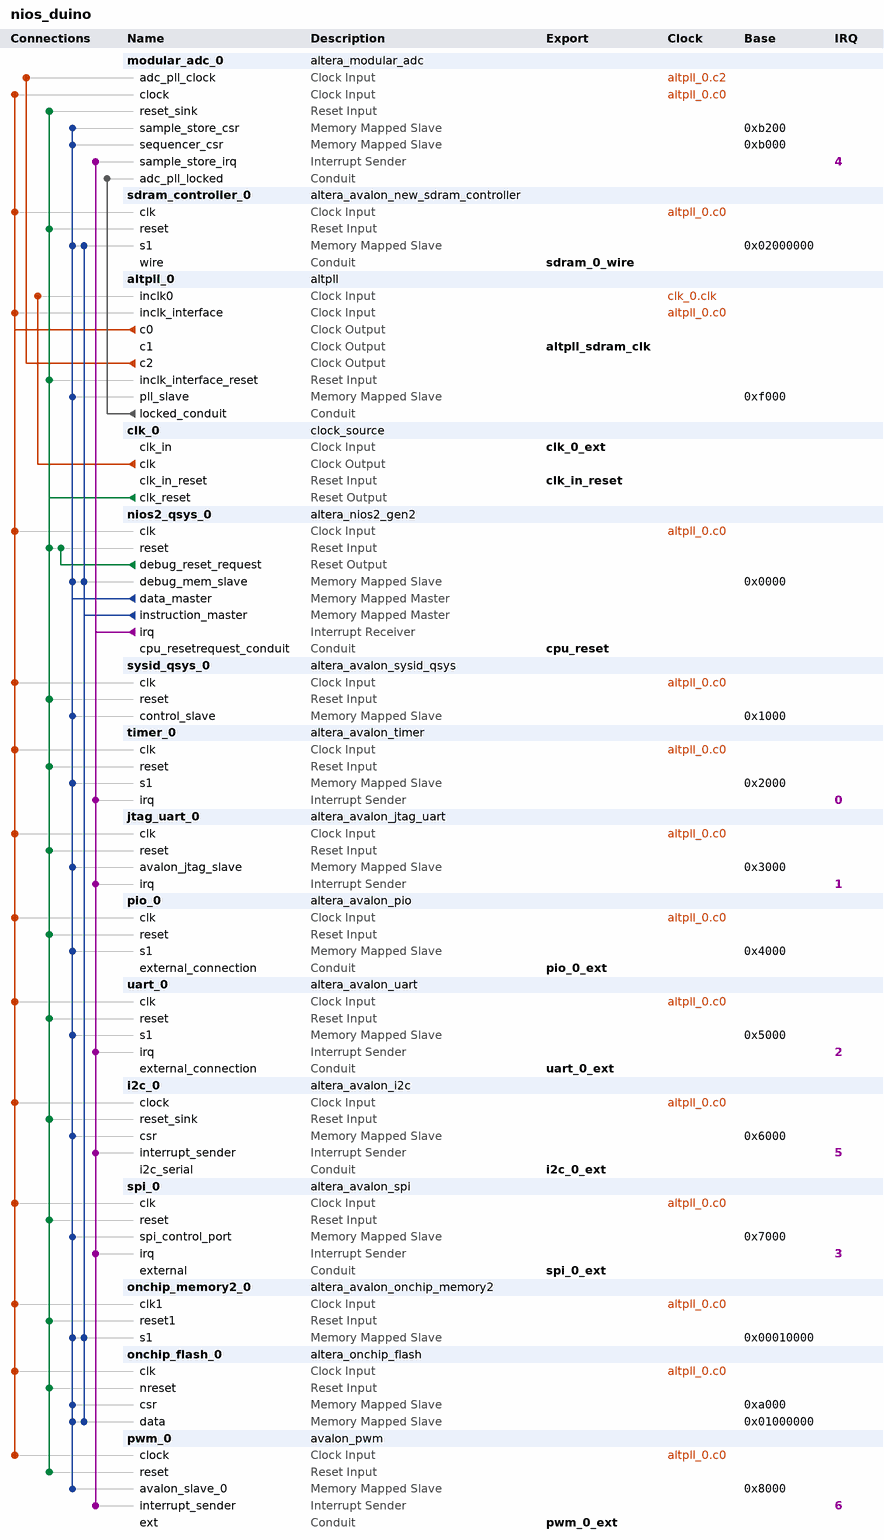
[diagram p0: system contents]
# Platform Designer (Qsys) system nios_duino, MAX 10 10M16SAU169C8G
# Parameters at their usual value, and those the tool derives, are not listed.
package require -exact qsys 17.0
create_system nios_duino
set_project_property DEVICE_FAMILY {MAX 10}
set_project_property DEVICE 10M16SAU169C8G

add_instance modular_adc_0 altera_modular_adc 17.0
set_instance_parameter_value modular_adc_0 CLOCK_FREQ 60000000
set_instance_parameter_value modular_adc_0 CORE_VAR 0
set_instance_parameter_value modular_adc_0 DEVICE_PART 10M16SAU169C8G
set_instance_parameter_value modular_adc_0 clkdiv 4
set_instance_parameter_value modular_adc_0 int_vref_vr 3.3
set_instance_parameter_value modular_adc_0 prescaler_ch8 true
set_instance_parameter_value modular_adc_0 refsel 1
set_instance_parameter_value modular_adc_0 sample_rate 0
set_instance_parameter_value modular_adc_0 seq_order_length 9
set_instance_parameter_value modular_adc_0 seq_order_slot_1 0
set_instance_parameter_value modular_adc_0 seq_order_slot_10 17
set_instance_parameter_value modular_adc_0 seq_order_slot_2 8
set_instance_parameter_value modular_adc_0 seq_order_slot_3 2
set_instance_parameter_value modular_adc_0 seq_order_slot_4 5
set_instance_parameter_value modular_adc_0 seq_order_slot_5 1
set_instance_parameter_value modular_adc_0 seq_order_slot_6 3
set_instance_parameter_value modular_adc_0 seq_order_slot_7 7
set_instance_parameter_value modular_adc_0 seq_order_slot_8 4
set_instance_parameter_value modular_adc_0 seq_order_slot_9 6
set_instance_parameter_value modular_adc_0 use_ch0 true
set_instance_parameter_value modular_adc_0 use_ch2 true
set_instance_parameter_value modular_adc_0 use_ch3 true
set_instance_parameter_value modular_adc_0 use_ch4 true
set_instance_parameter_value modular_adc_0 use_ch5 true
set_instance_parameter_value modular_adc_0 use_ch6 true
set_instance_parameter_value modular_adc_0 use_ch7 true
set_instance_parameter_value modular_adc_0 use_ch8 true
set_instance_parameter_value modular_adc_0 use_tsd true

add_instance sdram_controller_0 altera_avalon_new_sdram_controller 17.0
set_instance_parameter_value sdram_controller_0 TAC 6.0
set_instance_parameter_value sdram_controller_0 TRCD 15.0
set_instance_parameter_value sdram_controller_0 TRFC 72.0
set_instance_parameter_value sdram_controller_0 TRP 15.0
set_instance_parameter_value sdram_controller_0 casLatency 2
set_instance_parameter_value sdram_controller_0 columnWidth 9
set_instance_parameter_value sdram_controller_0 dataWidth 16
set_instance_parameter_value sdram_controller_0 generateSimulationModel false
set_instance_parameter_value sdram_controller_0 model single_Micron_MT48LC4M32B2_7_chip
set_instance_parameter_value sdram_controller_0 numberOfBanks 4
set_instance_parameter_value sdram_controller_0 numberOfChipSelects 1
set_instance_parameter_value sdram_controller_0 powerUpDelay 200.0
set_instance_parameter_value sdram_controller_0 refreshPeriod 15.625
set_instance_parameter_value sdram_controller_0 rowWidth 13

add_instance altpll_0 altpll 17.0
set_instance_parameter_value altpll_0 AVALON_USE_SEPARATE_SYSCLK YES
set_instance_parameter_value altpll_0 CLK0_DIVIDE_BY 1
set_instance_parameter_value altpll_0 CLK0_MULTIPLY_BY 5
set_instance_parameter_value altpll_0 CLK1_DIVIDE_BY 1
set_instance_parameter_value altpll_0 CLK1_DUTY_CYCLE 50
set_instance_parameter_value altpll_0 CLK1_MULTIPLY_BY 5
set_instance_parameter_value altpll_0 CLK1_PHASE_SHIFT -4167
set_instance_parameter_value altpll_0 CLK2_DIVIDE_BY 3
set_instance_parameter_value altpll_0 CLK2_DUTY_CYCLE 50
set_instance_parameter_value altpll_0 CLK2_MULTIPLY_BY 10
set_instance_parameter_value altpll_0 CLK2_PHASE_SHIFT 0
set_instance_parameter_value altpll_0 INCLK0_INPUT_FREQUENCY 83333
set_instance_parameter_value altpll_0 PORT_ARESET PORT_UNUSED
set_instance_parameter_value altpll_0 PORT_LOCKED PORT_USED
set_instance_parameter_value altpll_0 PORT_clk1 PORT_USED
set_instance_parameter_value altpll_0 PORT_clk2 PORT_USED
set_instance_parameter_value altpll_0 PORT_clk3 PORT_UNUSED

add_instance clk_0 clock_source 17.0
set_instance_parameter_value clk_0 clockFrequency 12000000

add_instance nios2_qsys_0 altera_nios2_gen2 17.0
set_instance_parameter_value nios2_qsys_0 cpuReset true
set_instance_parameter_value nios2_qsys_0 dcache_size 2048
set_instance_parameter_value nios2_qsys_0 exceptionSlave sdram_controller_0.s1
set_instance_parameter_value nios2_qsys_0 icache_size 4096
set_instance_parameter_value nios2_qsys_0 impl Tiny
set_instance_parameter_value nios2_qsys_0 resetSlave onchip_flash_0.data
set_instance_parameter_value nios2_qsys_0 resetrequest_enabled false
set_instance_parameter_value nios2_qsys_0 setting_activateTrace true

add_instance sysid_qsys_0 altera_avalon_sysid_qsys 17.0
set_instance_parameter_value sysid_qsys_0 id 17149200

add_instance timer_0 altera_avalon_timer 17.0
set_instance_parameter_value timer_0 period 1
set_instance_parameter_value timer_0 periodUnits MSEC

add_instance jtag_uart_0 altera_avalon_jtag_uart 17.0
set_instance_parameter_value jtag_uart_0 allowMultipleConnections true
set_instance_parameter_value jtag_uart_0 readBufferDepth 32
set_instance_parameter_value jtag_uart_0 simInteractiveOptions NO_INTERACTIVE_WINDOWS
set_instance_parameter_value jtag_uart_0 writeBufferDepth 128

add_instance pio_0 altera_avalon_pio 17.0
set_instance_parameter_value pio_0 bitModifyingOutReg true
set_instance_parameter_value pio_0 direction Bidir
set_instance_parameter_value pio_0 width 16

add_instance uart_0 altera_avalon_uart 17.0
set_instance_parameter_value uart_0 baud 115200
set_instance_parameter_value uart_0 dataBits 8
set_instance_parameter_value uart_0 fixedBaud false
set_instance_parameter_value uart_0 parity NONE
set_instance_parameter_value uart_0 stopBits 1

add_instance i2c_0 altera_avalon_i2c 17.0
set_instance_parameter_value i2c_0 FIFO_DEPTH 4

add_instance spi_0 altera_avalon_spi 17.0
set_instance_parameter_value spi_0 clockPolarity 0
set_instance_parameter_value spi_0 dataWidth 8
set_instance_parameter_value spi_0 masterSPI true
set_instance_parameter_value spi_0 numberOfSlaves 1
set_instance_parameter_value spi_0 targetClockRate 128000

add_instance onchip_memory2_0 altera_avalon_onchip_memory2 17.0
set_instance_parameter_value onchip_memory2_0 dataWidth 32
set_instance_parameter_value onchip_memory2_0 dualPort false
set_instance_parameter_value onchip_memory2_0 initMemContent false
set_instance_parameter_value onchip_memory2_0 initializationFileName onchip_mem.hex
set_instance_parameter_value onchip_memory2_0 memorySize 40960

add_instance onchip_flash_0 altera_onchip_flash 17.0
set_instance_parameter_value onchip_flash_0 CLOCK_FREQUENCY 50.0
set_instance_parameter_value onchip_flash_0 CONFIGURATION_MODE {Single Uncompressed Image}
set_instance_parameter_value onchip_flash_0 SECTOR_ACCESS_MODE {Read and write,Read and write,Read and write,Read and write,Read and write}
set_instance_parameter_value onchip_flash_0 initFlashContent false
set_instance_parameter_value onchip_flash_0 initializationFileName altera_onchip_flash.hex
set_instance_parameter_value onchip_flash_0 useNonDefaultInitFile false

add_instance pwm_0 avalon_pwm 1.0
set_instance_parameter_value pwm_0 CLK_PRESCALER_WIDTH 16
set_instance_parameter_value pwm_0 CONSTANT_MAX true
set_instance_parameter_value pwm_0 PRELOAD_REGS false
set_instance_parameter_value pwm_0 PULSE_DITHER false
set_instance_parameter_value pwm_0 PWM_COUNTER_WIDTH 8
set_instance_parameter_value pwm_0 PWM_OUTPUTS_COUNT 4

# connections
add_connection altpll_0.c0 altpll_0.inclk_interface clock
add_connection altpll_0.c0 i2c_0.clock clock
add_connection altpll_0.c0 jtag_uart_0.clk clock
add_connection altpll_0.c0 modular_adc_0.clock clock
add_connection altpll_0.c0 nios2_qsys_0.clk clock
add_connection altpll_0.c0 onchip_flash_0.clk clock
add_connection altpll_0.c0 onchip_memory2_0.clk1 clock
add_connection altpll_0.c0 pio_0.clk clock
add_connection altpll_0.c0 pwm_0.clock clock
add_connection altpll_0.c0 sdram_controller_0.clk clock
add_connection altpll_0.c0 spi_0.clk clock
add_connection altpll_0.c0 sysid_qsys_0.clk clock
add_connection altpll_0.c0 timer_0.clk clock
add_connection altpll_0.c0 uart_0.clk clock
add_connection altpll_0.c2 modular_adc_0.adc_pll_clock clock
add_connection clk_0.clk altpll_0.inclk0 clock
add_connection clk_0.clk_reset altpll_0.inclk_interface_reset reset
add_connection clk_0.clk_reset i2c_0.reset_sink reset
add_connection clk_0.clk_reset jtag_uart_0.reset reset
add_connection clk_0.clk_reset modular_adc_0.reset_sink reset
add_connection clk_0.clk_reset nios2_qsys_0.reset reset
add_connection clk_0.clk_reset onchip_flash_0.nreset reset
add_connection clk_0.clk_reset onchip_memory2_0.reset1 reset
add_connection clk_0.clk_reset pio_0.reset reset
add_connection clk_0.clk_reset pwm_0.reset reset
add_connection clk_0.clk_reset sdram_controller_0.reset reset
add_connection clk_0.clk_reset spi_0.reset reset
add_connection clk_0.clk_reset sysid_qsys_0.reset reset
add_connection clk_0.clk_reset timer_0.reset reset
add_connection clk_0.clk_reset uart_0.reset reset
add_connection nios2_qsys_0.debug_reset_request nios2_qsys_0.reset reset
add_connection nios2_qsys_0.data_master altpll_0.pll_slave avalon
set_connection_parameter_value nios2_qsys_0.data_master/altpll_0.pll_slave baseAddress 0xf000
add_connection nios2_qsys_0.data_master i2c_0.csr avalon
set_connection_parameter_value nios2_qsys_0.data_master/i2c_0.csr baseAddress 0x6000
add_connection nios2_qsys_0.data_master jtag_uart_0.avalon_jtag_slave avalon
set_connection_parameter_value nios2_qsys_0.data_master/jtag_uart_0.avalon_jtag_slave baseAddress 0x3000
add_connection nios2_qsys_0.data_master modular_adc_0.sample_store_csr avalon
set_connection_parameter_value nios2_qsys_0.data_master/modular_adc_0.sample_store_csr baseAddress 0xb200
add_connection nios2_qsys_0.data_master modular_adc_0.sequencer_csr avalon
set_connection_parameter_value nios2_qsys_0.data_master/modular_adc_0.sequencer_csr baseAddress 0xb000
add_connection nios2_qsys_0.data_master nios2_qsys_0.debug_mem_slave avalon
set_connection_parameter_value nios2_qsys_0.data_master/nios2_qsys_0.debug_mem_slave baseAddress 0x0000
add_connection nios2_qsys_0.data_master onchip_flash_0.csr avalon
set_connection_parameter_value nios2_qsys_0.data_master/onchip_flash_0.csr baseAddress 0xa000
add_connection nios2_qsys_0.data_master onchip_flash_0.data avalon
set_connection_parameter_value nios2_qsys_0.data_master/onchip_flash_0.data baseAddress 0x01000000
add_connection nios2_qsys_0.data_master onchip_memory2_0.s1 avalon
set_connection_parameter_value nios2_qsys_0.data_master/onchip_memory2_0.s1 baseAddress 0x00010000
add_connection nios2_qsys_0.data_master pio_0.s1 avalon
set_connection_parameter_value nios2_qsys_0.data_master/pio_0.s1 baseAddress 0x4000
add_connection nios2_qsys_0.data_master pwm_0.avalon_slave_0 avalon
set_connection_parameter_value nios2_qsys_0.data_master/pwm_0.avalon_slave_0 baseAddress 0x8000
add_connection nios2_qsys_0.data_master sdram_controller_0.s1 avalon
set_connection_parameter_value nios2_qsys_0.data_master/sdram_controller_0.s1 baseAddress 0x02000000
add_connection nios2_qsys_0.data_master spi_0.spi_control_port avalon
set_connection_parameter_value nios2_qsys_0.data_master/spi_0.spi_control_port baseAddress 0x7000
add_connection nios2_qsys_0.data_master sysid_qsys_0.control_slave avalon
set_connection_parameter_value nios2_qsys_0.data_master/sysid_qsys_0.control_slave baseAddress 0x1000
add_connection nios2_qsys_0.data_master timer_0.s1 avalon
set_connection_parameter_value nios2_qsys_0.data_master/timer_0.s1 baseAddress 0x2000
add_connection nios2_qsys_0.data_master uart_0.s1 avalon
set_connection_parameter_value nios2_qsys_0.data_master/uart_0.s1 baseAddress 0x5000
add_connection nios2_qsys_0.instruction_master nios2_qsys_0.debug_mem_slave avalon
set_connection_parameter_value nios2_qsys_0.instruction_master/nios2_qsys_0.debug_mem_slave baseAddress 0x0000
add_connection nios2_qsys_0.instruction_master onchip_flash_0.data avalon
set_connection_parameter_value nios2_qsys_0.instruction_master/onchip_flash_0.data baseAddress 0x01000000
add_connection nios2_qsys_0.instruction_master onchip_memory2_0.s1 avalon
set_connection_parameter_value nios2_qsys_0.instruction_master/onchip_memory2_0.s1 baseAddress 0x00010000
add_connection nios2_qsys_0.instruction_master sdram_controller_0.s1 avalon
set_connection_parameter_value nios2_qsys_0.instruction_master/sdram_controller_0.s1 baseAddress 0x02000000
add_connection altpll_0.locked_conduit modular_adc_0.adc_pll_locked conduit
add_connection nios2_qsys_0.irq i2c_0.interrupt_sender interrupt
set_connection_parameter_value nios2_qsys_0.irq/i2c_0.interrupt_sender irqNumber 5
add_connection nios2_qsys_0.irq jtag_uart_0.irq interrupt
set_connection_parameter_value nios2_qsys_0.irq/jtag_uart_0.irq irqNumber 1
add_connection nios2_qsys_0.irq modular_adc_0.sample_store_irq interrupt
set_connection_parameter_value nios2_qsys_0.irq/modular_adc_0.sample_store_irq irqNumber 4
add_connection nios2_qsys_0.irq pwm_0.interrupt_sender interrupt
set_connection_parameter_value nios2_qsys_0.irq/pwm_0.interrupt_sender irqNumber 6
add_connection nios2_qsys_0.irq spi_0.irq interrupt
set_connection_parameter_value nios2_qsys_0.irq/spi_0.irq irqNumber 3
add_connection nios2_qsys_0.irq timer_0.irq interrupt
set_connection_parameter_value nios2_qsys_0.irq/timer_0.irq irqNumber 0
add_connection nios2_qsys_0.irq uart_0.irq interrupt
set_connection_parameter_value nios2_qsys_0.irq/uart_0.irq irqNumber 2

# exported interfaces
add_interface altpll_sdram_clk clock source
set_interface_property altpll_sdram_clk EXPORT_OF altpll_0.c1
add_interface clk_0_ext clock sink
set_interface_property clk_0_ext EXPORT_OF clk_0.clk_in
add_interface clk_in_reset reset sink
set_interface_property clk_in_reset EXPORT_OF clk_0.clk_in_reset
add_interface cpu_reset conduit end
set_interface_property cpu_reset EXPORT_OF nios2_qsys_0.cpu_resetrequest_conduit
add_interface i2c_0_ext conduit end
set_interface_property i2c_0_ext EXPORT_OF i2c_0.i2c_serial
add_interface pio_0_ext conduit end
set_interface_property pio_0_ext EXPORT_OF pio_0.external_connection
add_interface pwm_0_ext conduit end
set_interface_property pwm_0_ext EXPORT_OF pwm_0.ext
add_interface sdram_0_wire conduit end
set_interface_property sdram_0_wire EXPORT_OF sdram_controller_0.wire
add_interface spi_0_ext conduit end
set_interface_property spi_0_ext EXPORT_OF spi_0.external
add_interface uart_0_ext conduit end
set_interface_property uart_0_ext EXPORT_OF uart_0.external_connection

set_interconnect_requirement {$system} qsys_mm.clockCrossingAdapter HANDSHAKE
set_interconnect_requirement {$system} qsys_mm.maxAdditionalLatency 1

save_system nios_duino.qsys
